# Altium schematic sheet Circuit1.SchDoc
size A; SheetNumber: 1; SheetTotal: 1; SPICEModelCacheSSZMORLW: <root> / <DocumentId>SSZMORLW</DocumentId> / </root>
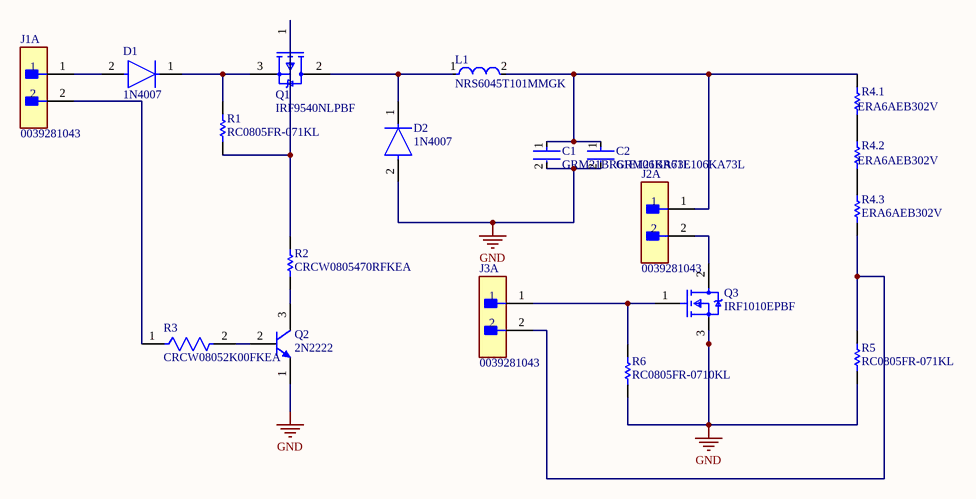
[diagram p0: Circuit1.SchDoc]

## Parts
C1  GRM21BR61E106KA73L  [FP-GRM21B-0_15-IPC_C]
C2  GRM21BR61E106KA73L  [FP-GRM21B-0_15-IPC_C]
D1  1N4007  [FP-1N4007-MFG]
D2  1N4007  [FP-1N4007-MFG]
J1  0039281043  [FP-0039281043-MFG]  (part A of 2)
J2  0039281043  [FP-0039281043-MFG]  (part A of 2)
J3  0039281043  [FP-0039281043-MFG]  (part A of 2)
L1  NRS6045T101MMGK  [FP-NR6045-MFG]
Q1  IRF9540NLPBF  [FP-PG-TO262-3-MFG]
Q2  2N2222  [MLTC-TO-18-3]
Q3  IRF1010EPBF  [FP-PG-TO220-3-MFG]
R1  RC0805FR-071KL  [RESC2013X60X35ML10T20]
R2  CRCW0805470RFKEA  [RESC2013X50X30LL20T20]
R3  CRCW08052K00FKEA  [FP-CRCW0805-e3-IPC_B]
R4.1  ERA6AEB302V  [RESC2013X60X40LL20T25]
R4.2  ERA6AEB302V  [RESC2013X60X40LL20T25]
R4.3  ERA6AEB302V  [RESC2013X60X40LL20T25]
R5  RC0805FR-071KL  [RESC2013X60X35ML10T20]
R6  RC0805FR-0710KL  [RESC2013X60X35NL10T20]

## Nets
GND: C1.2 C2.2 D2.2(A) Q2.1(E) Q3.3(S) R5.2 R6.2
NetC1_1: C1.1 C2.1 J2.1 L1.2 R4.1.1
NetD1_1: D1.1(C) Q1.3(Source) R1.1
NetD1_2: D1.2(A) J1.1
NetD2_1: D2.1(C) L1.1 Q1.2(Drain)
NetJ1_2: J1.2 R3.1
NetJ2_2: J2.2 Q3.2(D)
NetJ3_1: J3.1 Q3.1(G) R6.1
NetJ3_2: J3.2 R4.3.2 R5.1
NetQ1_1: Q1.1(Gate) R1.2 R2.1
NetQ2_2: Q2.2(B) R3.2
NetQ2_3: Q2.3(C) R2.2
NetR4.1_2: R4.1.2 R4.2.1
NetR4.2_2: R4.2.2 R4.3.1

## Library data of the parts
C1 C2 = CMP-2007-03541-2: Chip Multilayer Ceramic Capacitors for General Purpose, 0805, 10uF, X5R, 15%, 10%, 25V; Length: 2mm; Depth: 1.25mm; Termination: SMD/SMT; Voltage: 25V; Height: 1.25mm; Material: Ceramic; Thickness: 0.053inch; Radiation Hardening: No; Min Operating Temperature: -55°C; Width: 0.049inch; Package Quantity: 1; Mount: Surface Mount; Dielectric: X5R; Packaging: Tape and Reel; Capacitance: 10uF; Voltage Rating (DC): 25V; Lead Free: Lead Free; Max Operating Temperature: 85°C; Case Code (Imperial): 0805; Case/Package: 0805; Tolerance: 10%; Voltage Rating: 25V; Case Code (Metric): 2012
D1 D2 = CMP-123542-000001-1: Rectifier diode 1000 V 1 A DO-41, ,; Manufacturer: Diotec; Max Surge Forward Current: 27A; Forward Current: 1A; Max Junction Temp: +175°C; Reverse Voltage: 1000V; Value: 15pF; Peak Reverse Current: 5uA; Category: Diode; Temperature Range Low: -50°C; Automotive: No; Temperature: -50°C to +175°C; Lead Free: Yes; ComponentLink2Description: Datasheet; Max Repetitive Reverse Voltage: 1000V; ComponentLink2URL: https://datasheet.octopart.com/1N4007-Diotec-datasheet-62346875.pdf; Manufacturer Part Number: 1N4007; Device Class L3: Rectifier Diodes; Height: 2.8mm; Octopart: https://octopart.com/1n4007-diotec-4040411; Package: 1N4007; Temperature Range High: +175°C; Device Class L1: Discrete Semiconductors; Device Class L2: Diodes; RoHS: TRUE; Capacitance: 15pF; Ipc Land Pattern Name: DIOAD888W100L520D280
J1-J3 = CMP-04776-000046-1: CONN HEADER VERT 4POS 4.2MM; Manufacturer: Molex; Conn Orientation: Vertical; Conn Gender: Male; Current Rating: 9A; Voltage Rating: 600V; Number Of Contacts: 4; Manufacturer Part Number: 0039281043; Lead Free: Yes; Category: Conn; Height: 13.1mm; ComponentLink2URL: https://www.molex.com/webdocs/datasheets/pdf/en-us/0039281043_PCB_HEADERS.pdf; Package: 0; Device Class L2: Headers and Wire Housings; Contact Material: Tin; Footprint Url: https://www.molex.com/pdm_docs/sd/039281043_sd.pdf; Device Class L1: Connectors; Temperature Range High: +105°C; Automotive: No; RoHS: TRUE; Temperature: -40°C to +105°C; Number Of Rows: 2; Digikey Description: CONN HEADER VERT 4POS 4.2MM; Pitch: 4.2mm; Temperature Range Low: -40°C; Octopart: https://octopart.com/39-28-1043-molex-7613; Device Class L3: unset; ComponentLink2Description: Datasheet
L1 = CMP-14484-001089-1: Shielded Wirewound Inductor 100uH 20% 0.9A 0.6058Ω SMD; Test Frequency: 100kHz; Self Resonant Frequency: 3MHz; DC Resistance (DCR): 605.8mR; RMS Current (Irms): 750mA; Saturation Current: 900mA; Core Material: Ferrite; Lead Free: Lead Free; Depth: 6.2mm; Shielding: Shielded; Radiation Hardening: No; Length: 6mm; Halogen Free: Halogen Free; Lead Pitch: 4.7mm; Termination: SMD/SMT; Height: 4.5mm; Inductance Tolerance: 20%; Series: NRS; Number of Pins: 2; Tolerance: 20%; Current Rating: 750mA; Max DC Current: 900mA; Resistor Type: Wirewound; Package Quantity: 1500; Height - Seated (Max): 0.177inch; Max Operating Temperature: 125°C; Case/Package: 6045; RoHS Compliant: Yes; Mount: Surface Mount; Packaging: Tape and Reel; Inductance: 100uH; Min Operating Temperature: -25°C; Width: 0.236inch
Q1 = CMP-32901-000518-1: MOSFET P-CH 100V 23A TO262-3; Number of Channels: 1; Max Dual Supply Voltage: -100V; Rise Time: 67ns; Max Power Dissipation: 3.1W; Gate to Source Voltage (Vgs): 20V; Drain to Source Resistance: 117mR; Turn-On Delay Time: 13ns; Turn-Off Delay Time: 40ns; Threshold Voltage: 4V; Input Capacitance: 1.45nF; Power Dissipation: 110W; Length: 0.42inch; Max Operating Temperature: 150°C; Case/Package: TO-262; Packaging: Rail/Tube; Height: 0.38inch; Drain to Source Voltage (Vdss): -100V; Lead Free: Contains Lead; Rds On Max: 117mR; Width: 0.19inch; Min Operating Temperature: -55°C; RoHS Compliant: Yes; Mount: Through Hole; Continuous Drain Current (ID): 23A; Number of Pins: 3; Halogen Free: Not Halogen Free; REACH SVHC: No SVHC
Q2 = CMP-2000-05237-1: Low Power Bipolar NPN Transistor, 30 V, -65 to 200 degC, 3-Pin TO-18, RoHS, Bulk; Manufacturer: Multicomp; Pin Configuration: a; No. of Pins: 3; No. of Transistors: 1; Collector Emitter Voltage Vces: 400mV; Current Ic Continuous a Max: 800mA; Power Dissipation Pd: 500mW; Collector Emitter Voltage V(br)ceo: 30V; Gain Bandwidth ft Typ: 250MHz; Voltage Vcbo: 60V; DC Current Gain hFE: 100; Full Power Rating Temperature: 25degC; Current Ic @ Vce Sat: 150mA; SVHC: NoSVHC(19-Dec-2012); Package Reference: TO-18-3; Package Description: 3-Pin Transistor Outline Package (TO-18), Dia 5.54 mm, Pitch Pitch 1.485mm; Datasheet URL: http://www.farnell.com/datasheets/1662272.pdf; Transistor Case Style: TO-18; Continuous Collector Current Ic Max: 800mA; Manufacturer URL: http://uk.farnell.com/b/multicomp; DC Collector Current: 800mA; Hfe Min: 100; Transistor Polarity: NPN; Power Dissipation Ptot Max: 500mW; Package / Case: TO-18; Datasheet Version: Rev. 1.1, 05/2012; Gain Bandwidth ft Min: 250MHz; Current Ic hFE: 150mA
Q3 = CMP-32901-000559-1: MOSFET N-CH 60V 84A TO-220AB; Element Configuration: Single; Turn-On Delay Time: 12ns; Gate to Source Voltage (Vgs): 20V; Rise Time: 78ns; Max Power Dissipation: 200W; Threshold Voltage: 4V; Rds On Max: 12mR; Turn-Off Delay Time: 48ns; Input Capacitance: 3.21nF; Packaging: Rail/Tube; Drain to Source Breakdown Voltage: 60V; RoHS Compliant: Yes; Min Operating Temperature: -55°C; Length: 0.42inch; Max Operating Temperature: 175°C; Continuous Drain Current (ID): 84A; Mount: Through Hole; Contact Plating: Tin; REACH SVHC: No SVHC; Power Dissipation: 200W; Height: 0.65inch; Drain to Source Voltage (Vdss): 60V; Drain to Source Resistance: 12mR; Case/Package: TO-220; Lead Free: Lead Free; Halogen Free: Not Halogen Free; Number of Pins: 3; Max Dual Supply Voltage: 60V; Width: 0.19inch
R1 R5 = CMP-2100-03671-1: Chip Resistor, 1 KOhm, +/- 1%, 125 mW, -55 to 155 degC, 0805 (2012 Metric), RoHS, Tape and Reel; Manufacturer: Yageo; Temperature Coefficient: 100ppm/degreesC; Voltage Rating (DC): 150V; Max Power Dissipation: 125mW; Resistance: 1KOhm; Number of Pins: 2; Number of Terminations: 2; Datasheet URL: http://www.yageo.com/NewPortal/yageodocoutput?fileName=/pdf/R-Chip/PYu-RC_Group_51_RoHS_L_5.pdf; Length: 0.079inch; Package Description: 2-Pin Surface Mounted Device, Body 2 x 1.25 mm; Depth: 1.25mm; Height: 0.024inch; Military Standard: Not; Case/Package: 0805; Package Reference: 0805; RoHSCompliant: true; Lead Free: LeadFree; Packaging: TapeandReel; Package Quantity: 1; Datasheet Version: Rev. 5, 10/2016; Tolerance: 1%; Min Operating Temperature: -55degC; Voltage Rating: 150V; Composition: ThickFilm; Case Code (Imperial): 0805; Power Rating: 125mW; Width: 0.049inch; Case Code (Metric): 2012; Manufacturer URL: http://www.yageo.com/; Max Operating Temperature: 155degC; REACH SVHC: Unknown; Termination: SMD/SMT
R2 = CMP-2001-03932-1: Manufacturer: Vishay Dale; Part Number: CRCW0805470RFKEA
R3 = CMP-2001-03755-2: RES Thick Film, 2kΩ, 1%, 0.125W, 100ppm/°C, 0805; Working Voltage: 150V; Max Power Dissipation: 125mW; Resistance: 2kR; Package Quantity: 10; Case Code (Metric): 2012; Voltage Rating: 150V; Number of Terminations: 2; Max Operating Temperature: 155°C; Depth: 1.25mm; Tolerance: 1%; Power Rating: 125mW; Lead Free: Lead Free; Case/Package: 0805; Features: Automotive AEC-Q200; Min Operating Temperature: -55°C; Termination: SMD/SMT; Case Code (Imperial): 0805; Weight: 0.000194oz; Packaging: Tape and Reel; Military Standard: Not; Radiation Hardening: No; Contact Plating: Tin; Mount: Surface Mount; Temperature Coefficient: 100ppm/°C; Height: 0.02inch; Number of Terminals: 2; Voltage Rating (DC): 150V; Number of Pins: 2; Length: 2mm; Width: 1.25mm; Composition: Thick Film
R4.1-R4.3 = CMP-2001-00625-1: Manufacturer: Panasonic; Part Number: ERA6AEB302V
R6 = CMP-1659-00013-4: Chip Resistor, 10 KOhm, +/- 1%, 0.125 W, -55 to 155 degC, 0805 (2012 Metric), RoHS, Tape and Reel; Manufacturer: Yageo; Voltage Rating: 150 V; Mount: Surface Mount; ComponentLink1Description: Manufacturer URL; ComponentLink2URL: http://www.yageo.com/documents/recent/PYu-RC_Group_51_RoHS_L_04.pdf; Pins: 2; Length: 2 mm; Min Operating Temperature: -55 degC; Height: 0.5 mm; Mounting Technology: Surface Mount; RoHSCompliant: true; REACH SVHC: No SVHC; ComponentLink1URL: http://www.yageo.com/; Max Operating Temperature: 155 degC; PackageReference: 0805; DatasheetVersion: Rev. 4, 02/2016; Package Quantity: 5000; Packaging: Tape and Reel; ComponentLink2Description: Datasheet; PackageDescription: 2-Pin Surface Mounted Device, Body 2 x 1.25 mm